# Altium schematic sheet 05-lnterface2.SchDoc
size A3; SheetNumber: 1; SheetTotal: 5
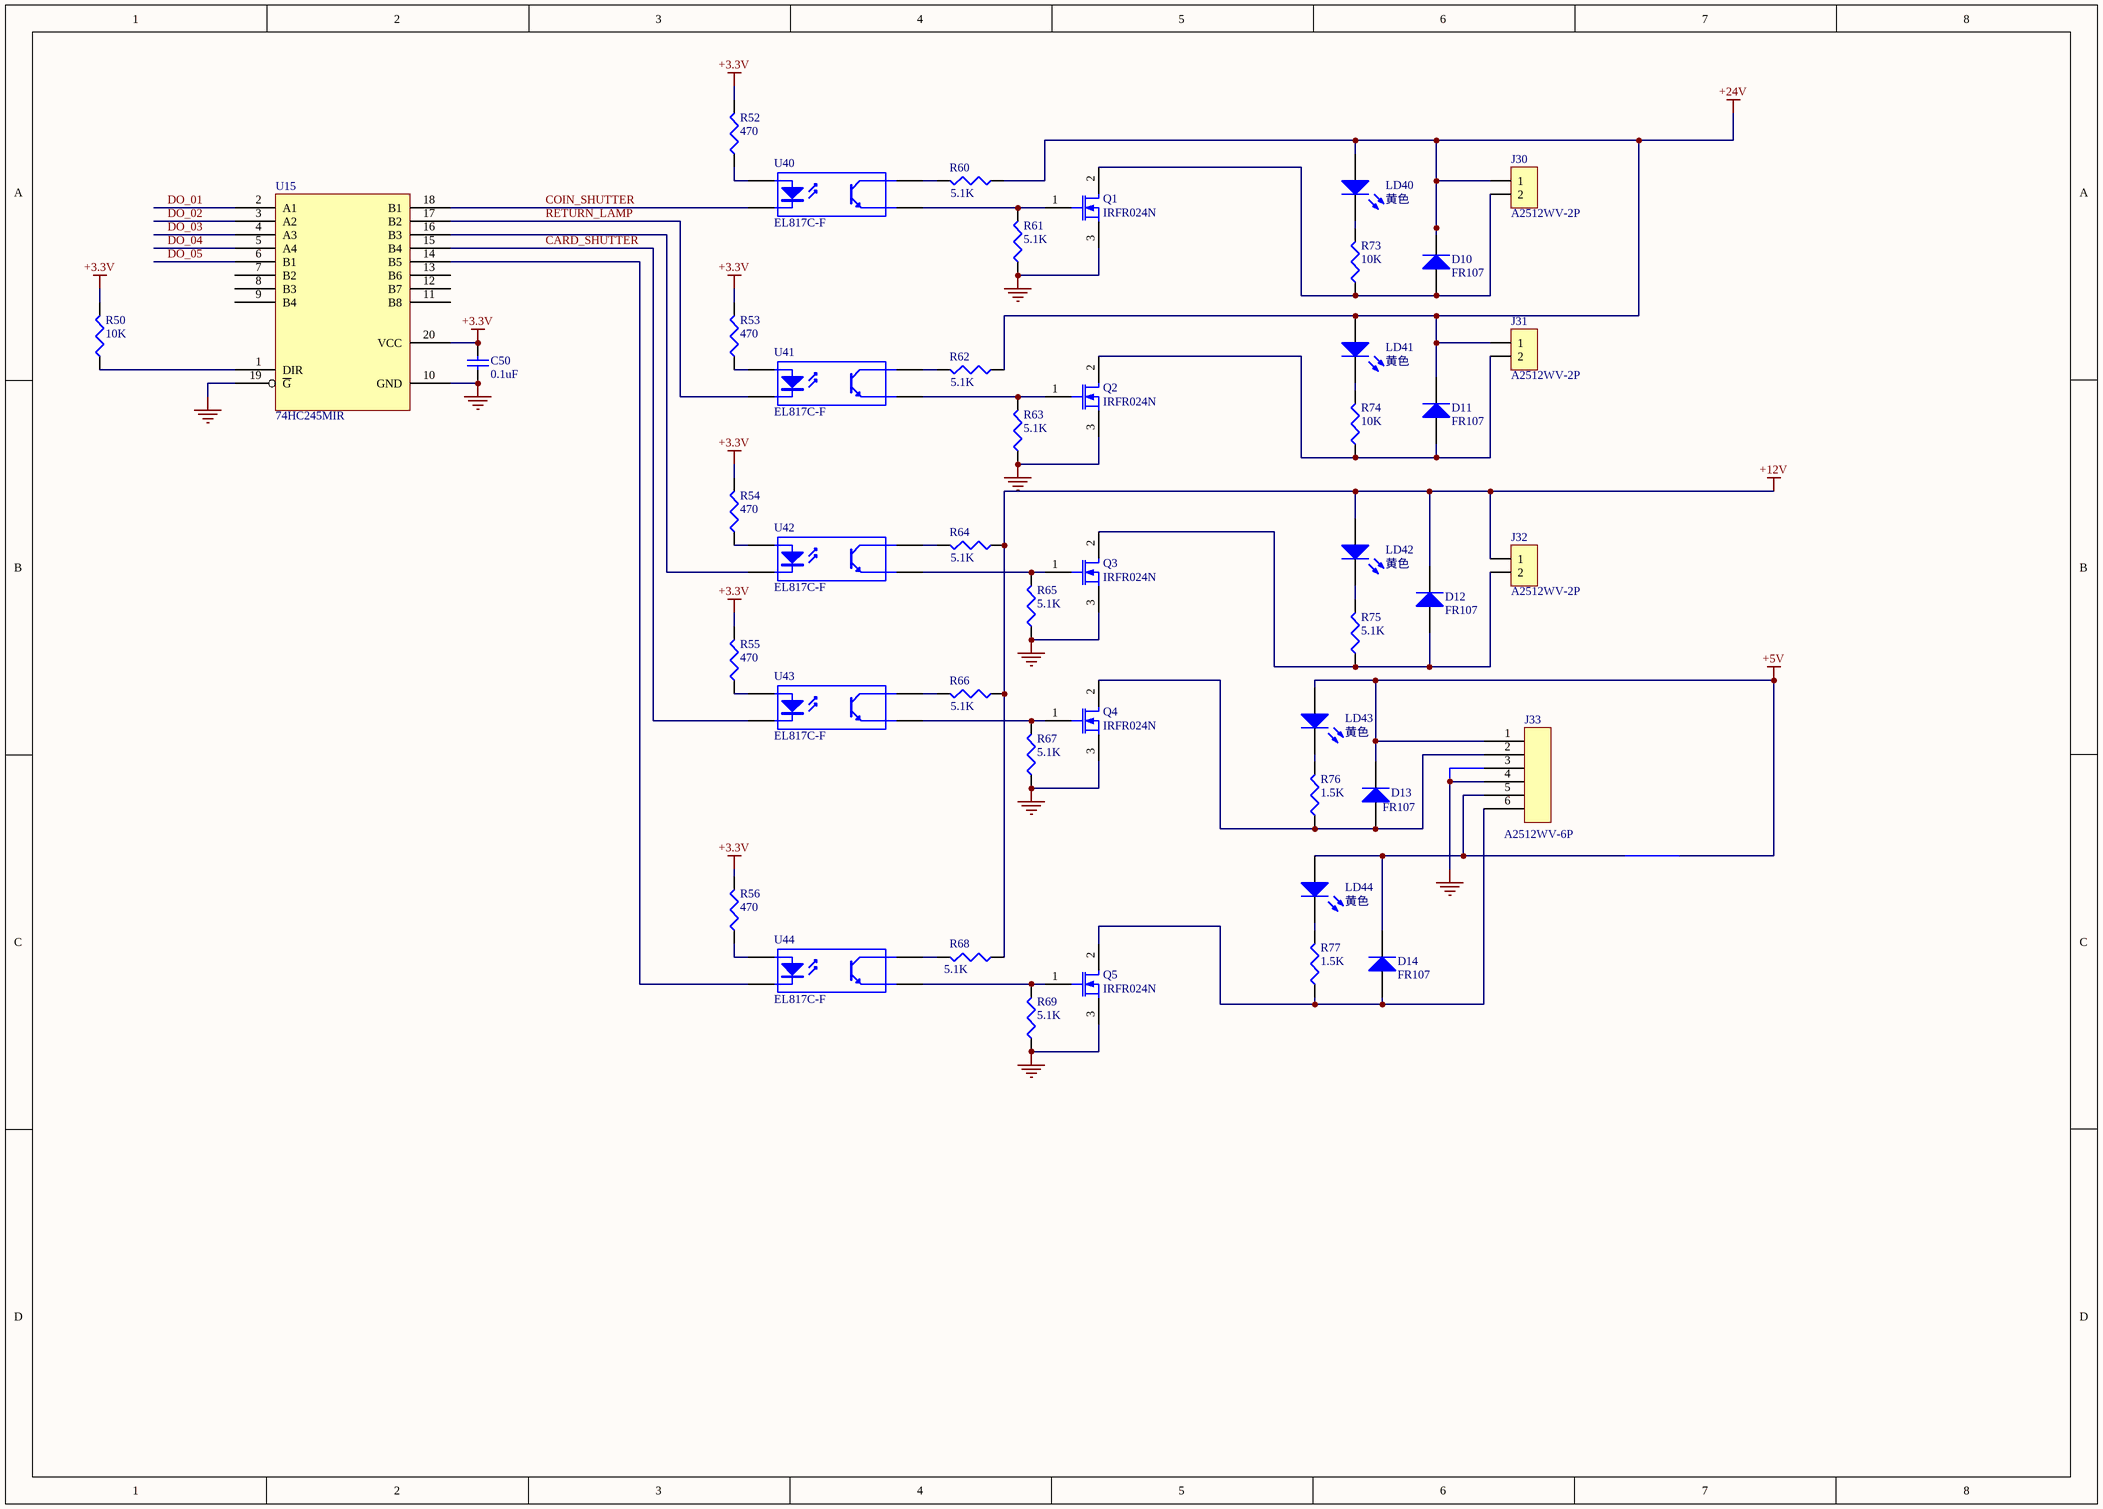
[diagram p0: 05-lnterface2.SchDoc]

## Parts
C50  value 0.1uF  [C0805]  (hidden comment: Cap)
D10  FR107  [FR107W]
D11  FR107  [FR107W]
D12  FR107  [FR107W]
D13  FR107  [FR107W]
D14  FR107  [FR107W]
J30  A2512WV-2P  [A2512WV-2P]
J31  A2512WV-2P  [A2512WV-2P]
J32  A2512WV-2P  [A2512WV-2P]
J33  A2512WV-6P  [A2512WV-6P]
LD40  黄色  [LED0805]
LD41  黄色  [LED0805]
LD42  黄色  [LED0805]
LD43  黄色  [LED0805]
LD44  黄色  [LED0805]
Q1  IRFR024N  [TO-252AA]
Q2  IRFR024N  [TO-252AA]
Q3  IRFR024N  [TO-252AA]
Q4  IRFR024N  [TO-252AA]
Q5  IRFR024N  [TO-252AA]
R50  value 10K  [R0805]  (hidden comment: Res3)
R52  value 470  [R0805]  (hidden comment: Res3)
R53  value 470  [R0805]  (hidden comment: Res3)
R54  value 470  [R0805]  (hidden comment: Res3)
R55  value 470  [R0805]  (hidden comment: Res3)
R56  value 470  [R0805]  (hidden comment: Res3)
R60  value 5.1K  [R0805]  (hidden comment: Res3)
R61  value 5.1K  [R0805]  (hidden comment: Res3)
R62  value 5.1K  [R0805]  (hidden comment: Res3)
R63  value 5.1K  [R0805]  (hidden comment: Res3)
R64  value 5.1K  [R0805]  (hidden comment: Res3)
R65  value 5.1K  [R0805]  (hidden comment: Res3)
R66  value 5.1K  [R0805]  (hidden comment: Res3)
R67  value 5.1K  [R0805]  (hidden comment: Res3)
R68  value 5.1K  [R0805]  (hidden comment: Res3)
R69  value 5.1K  [R0805]  (hidden comment: Res3)
R73  value 10K  [R0805]  (hidden comment: Res3)
R74  value 10K  [R0805]  (hidden comment: Res3)
R75  value 5.1K  [R0805]  (hidden comment: Res3)
R76  value 1.5K  [R0805]  (hidden comment: Res3)
R77  value 1.5K  [R0805]  (hidden comment: Res3)
U15  74HC245MIR  [SSOP-20]
U40  EL817C-F  [EL817-S]
U41  EL817C-F  [EL817-S]
U42  EL817C-F  [EL817-S]
U43  EL817C-F  [EL817-S]
U44  EL817C-F  [EL817-S]

## Nets
+3.3V: C50.2 R50.2 R52.2 R53.2 R54.2 R55.2 R56.2 U15.20(VCC)
+5V: D13.2(K) D14.2(K) J33.1 J33.5 LD43.1(A) LD44.1(A)
+12V: D12.2(K) J32.1 LD42.1(A) R64.1 R66.1 R68.1
+24V: D10.2(K) D11.2(K) J30.1 J31.1 LD40.1(A) LD41.1(A) R60.1 R62.1
GND: C50.1 J33.3 J33.4 Q1.3 Q2.3 Q3.3 Q4.3 Q5.3 R61.1 R63.1 R65.1 R67.1 R69.1 U15.10(GND) U15.19(~{G})
CARD_SHUTTER: U15.15(B4) U43.2(K)
COIN_SHUTTER: U15.18(B1) U40.2(K)
DO_01: U15.2(A1)
DO_02: U15.3(A2)
DO_03: U15.4(A3)
DO_04: U15.5(A4)
DO_05: U15.6(B1)
RETURN_LAMP: U15.17(B2) U41.2(K)
NetD10_1: D10.1(A) J30.2 Q1.2 R73.1
NetD11_1: D11.1(A) J31.2 Q2.2 R74.1
NetD12_1: D12.1(A) J32.2 Q3.2 R75.1
NetD13_1: D13.1(A) J33.2 Q4.2 R76.1
NetD14_1: D14.1(A) J33.6 Q5.2 R77.1
NetLD40_2: LD40.2(K) R73.2
NetLD41_2: LD41.2(K) R74.2
NetLD42_2: LD42.2(K) R75.2
NetLD43_2: LD43.2(K) R76.2
NetLD44_2: LD44.2(K) R77.2
NetQ1_1: Q1.1 R61.2 U40.4(E)
NetQ2_1: Q2.1 R63.2 U41.4(E)
NetQ3_1: Q3.1 R65.2 U42.4(E)
NetQ4_1: Q4.1 R67.2 U43.4(E)
NetQ5_1: Q5.1 R69.2 U44.4(E)
NetR50_1: R50.1 U15.1(DIR)
NetR52_1: R52.1 U40.1(A)
NetR53_1: R53.1 U41.1(A)
NetR54_1: R54.1 U42.1(A)
NetR55_1: R55.1 U43.1(A)
NetR56_1: R56.1 U44.1(A)
NetR60_2: R60.2 U40.3(C)
NetR62_2: R62.2 U41.3(C)
NetR64_2: R64.2 U42.3(C)
NetR66_2: R66.2 U43.3(C)
NetR68_2: R68.2 U44.3(C)
NetU15_14: U15.14(B5) U44.2(K)
NetU15_16: U15.16(B3) U42.2(K)

Not connected (* = marked no-connect by the designer): U15 7(B2) 8(B3) 9(B4) 11(B8) 12(B7) 13(B6)

## Library data of the parts
C50 = Cap: Capacitor; Published: 8-Jun-2000; LatestRevisionDate: 17-Jul-2002; LatestRevisionNote: Re-released for DXP Platform.; Publisher: Altium Limited
LD40-LD44 = LED0: Typical INFRARED GaAs LED; Published: 8-Jun-2000; LatestRevisionDate: 17-Jul-2002; LatestRevisionNote: Re-released for DXP Platform.; Publisher: Altium Limited
R50 R52-R56 R60-R69 R73-R77 = Res3: Resistor; Published: 8-Jun-2000; LatestRevisionDate: 17-Jul-2002; LatestRevisionNote: Re-released for DXP Platform.; Publisher: Altium Limited
U40-U44 = Optoisolator1: Optoisolator; Published: 24-Mar-1999; LatestRevisionDate: 17-Jul-2002; LatestRevisionNote: Re-released for DXP Platform.; Publisher: Altium Limited